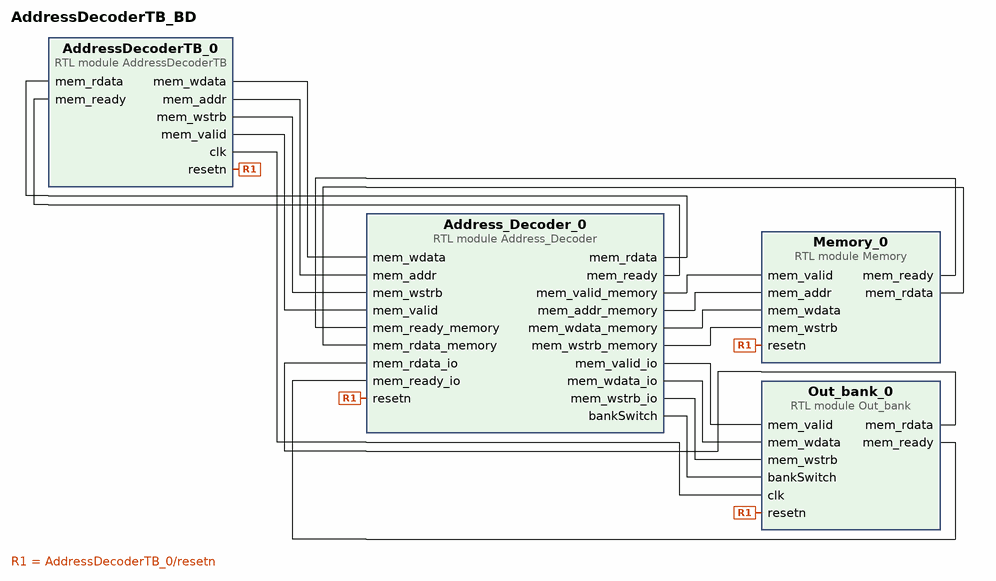
[diagram p0: block diagram of the top level]
# Vivado block design AddressDecoderTB_BD, xc7z020clg484-1, Vivado 2017.4
create_bd_design AddressDecoderTB_BD

create_bd_cell -type module -reference Memory Memory_0
create_bd_cell -type module -reference Out_bank Out_bank_0
create_bd_cell -type module -reference Address_Decoder Address_Decoder_0
set_property -dict [list \
  CONFIG.MEMORY_ENDADDRESS 0x000007FF \
  CONFIG.IO_STARTADDRESS 0x00000800 \
  CONFIG.IO_ENDADDRESS 0x00000801 \
] [get_bd_cells Address_Decoder_0]
create_bd_cell -type module -reference AddressDecoderTB AddressDecoderTB_0

# ---- connections ----

connect_bd_net [get_bd_pins AddressDecoderTB_0/resetn] \
  [get_bd_pins Memory_0/resetn] [get_bd_pins Out_bank_0/resetn] [get_bd_pins Address_Decoder_0/resetn]
connect_bd_net [get_bd_pins AddressDecoderTB_0/mem_wdata] [get_bd_pins Address_Decoder_0/mem_wdata]
connect_bd_net [get_bd_pins AddressDecoderTB_0/mem_addr] [get_bd_pins Address_Decoder_0/mem_addr]
connect_bd_net [get_bd_pins AddressDecoderTB_0/mem_wstrb] [get_bd_pins Address_Decoder_0/mem_wstrb]
connect_bd_net [get_bd_pins AddressDecoderTB_0/mem_valid] [get_bd_pins Address_Decoder_0/mem_valid]
connect_bd_net [get_bd_pins Address_Decoder_0/mem_rdata] [get_bd_pins AddressDecoderTB_0/mem_rdata]
connect_bd_net [get_bd_pins Address_Decoder_0/mem_ready] [get_bd_pins AddressDecoderTB_0/mem_ready]
connect_bd_net [get_bd_pins Address_Decoder_0/mem_valid_memory] [get_bd_pins Memory_0/mem_valid]
connect_bd_net [get_bd_pins Address_Decoder_0/mem_addr_memory] [get_bd_pins Memory_0/mem_addr]
connect_bd_net [get_bd_pins Address_Decoder_0/mem_wdata_memory] [get_bd_pins Memory_0/mem_wdata]
connect_bd_net [get_bd_pins Address_Decoder_0/mem_wstrb_memory] [get_bd_pins Memory_0/mem_wstrb]
connect_bd_net [get_bd_pins Memory_0/mem_ready] [get_bd_pins Address_Decoder_0/mem_ready_memory]
connect_bd_net [get_bd_pins Memory_0/mem_rdata] [get_bd_pins Address_Decoder_0/mem_rdata_memory]
connect_bd_net [get_bd_pins AddressDecoderTB_0/clk] [get_bd_pins Out_bank_0/clk]
connect_bd_net [get_bd_pins Address_Decoder_0/mem_valid_io] [get_bd_pins Out_bank_0/mem_valid]
connect_bd_net [get_bd_pins Address_Decoder_0/mem_wdata_io] [get_bd_pins Out_bank_0/mem_wdata]
connect_bd_net [get_bd_pins Address_Decoder_0/mem_wstrb_io] [get_bd_pins Out_bank_0/mem_wstrb]
connect_bd_net [get_bd_pins Address_Decoder_0/bankSwitch] [get_bd_pins Out_bank_0/bankSwitch]
connect_bd_net [get_bd_pins Out_bank_0/mem_rdata] [get_bd_pins Address_Decoder_0/mem_rdata_io]
connect_bd_net [get_bd_pins Out_bank_0/mem_ready] [get_bd_pins Address_Decoder_0/mem_ready_io]

validate_bd_design
save_bd_design
